# EasyEDA schematic SCH_Task7.3D PCB Design_2022-05-29.json
TITLE: Task 7.3D Canvas; REV: 1.0; Date: 2022-05-29; Sheet: 1/1; Drawn By: djsmit@deakin.edu.au; Company: Your Company
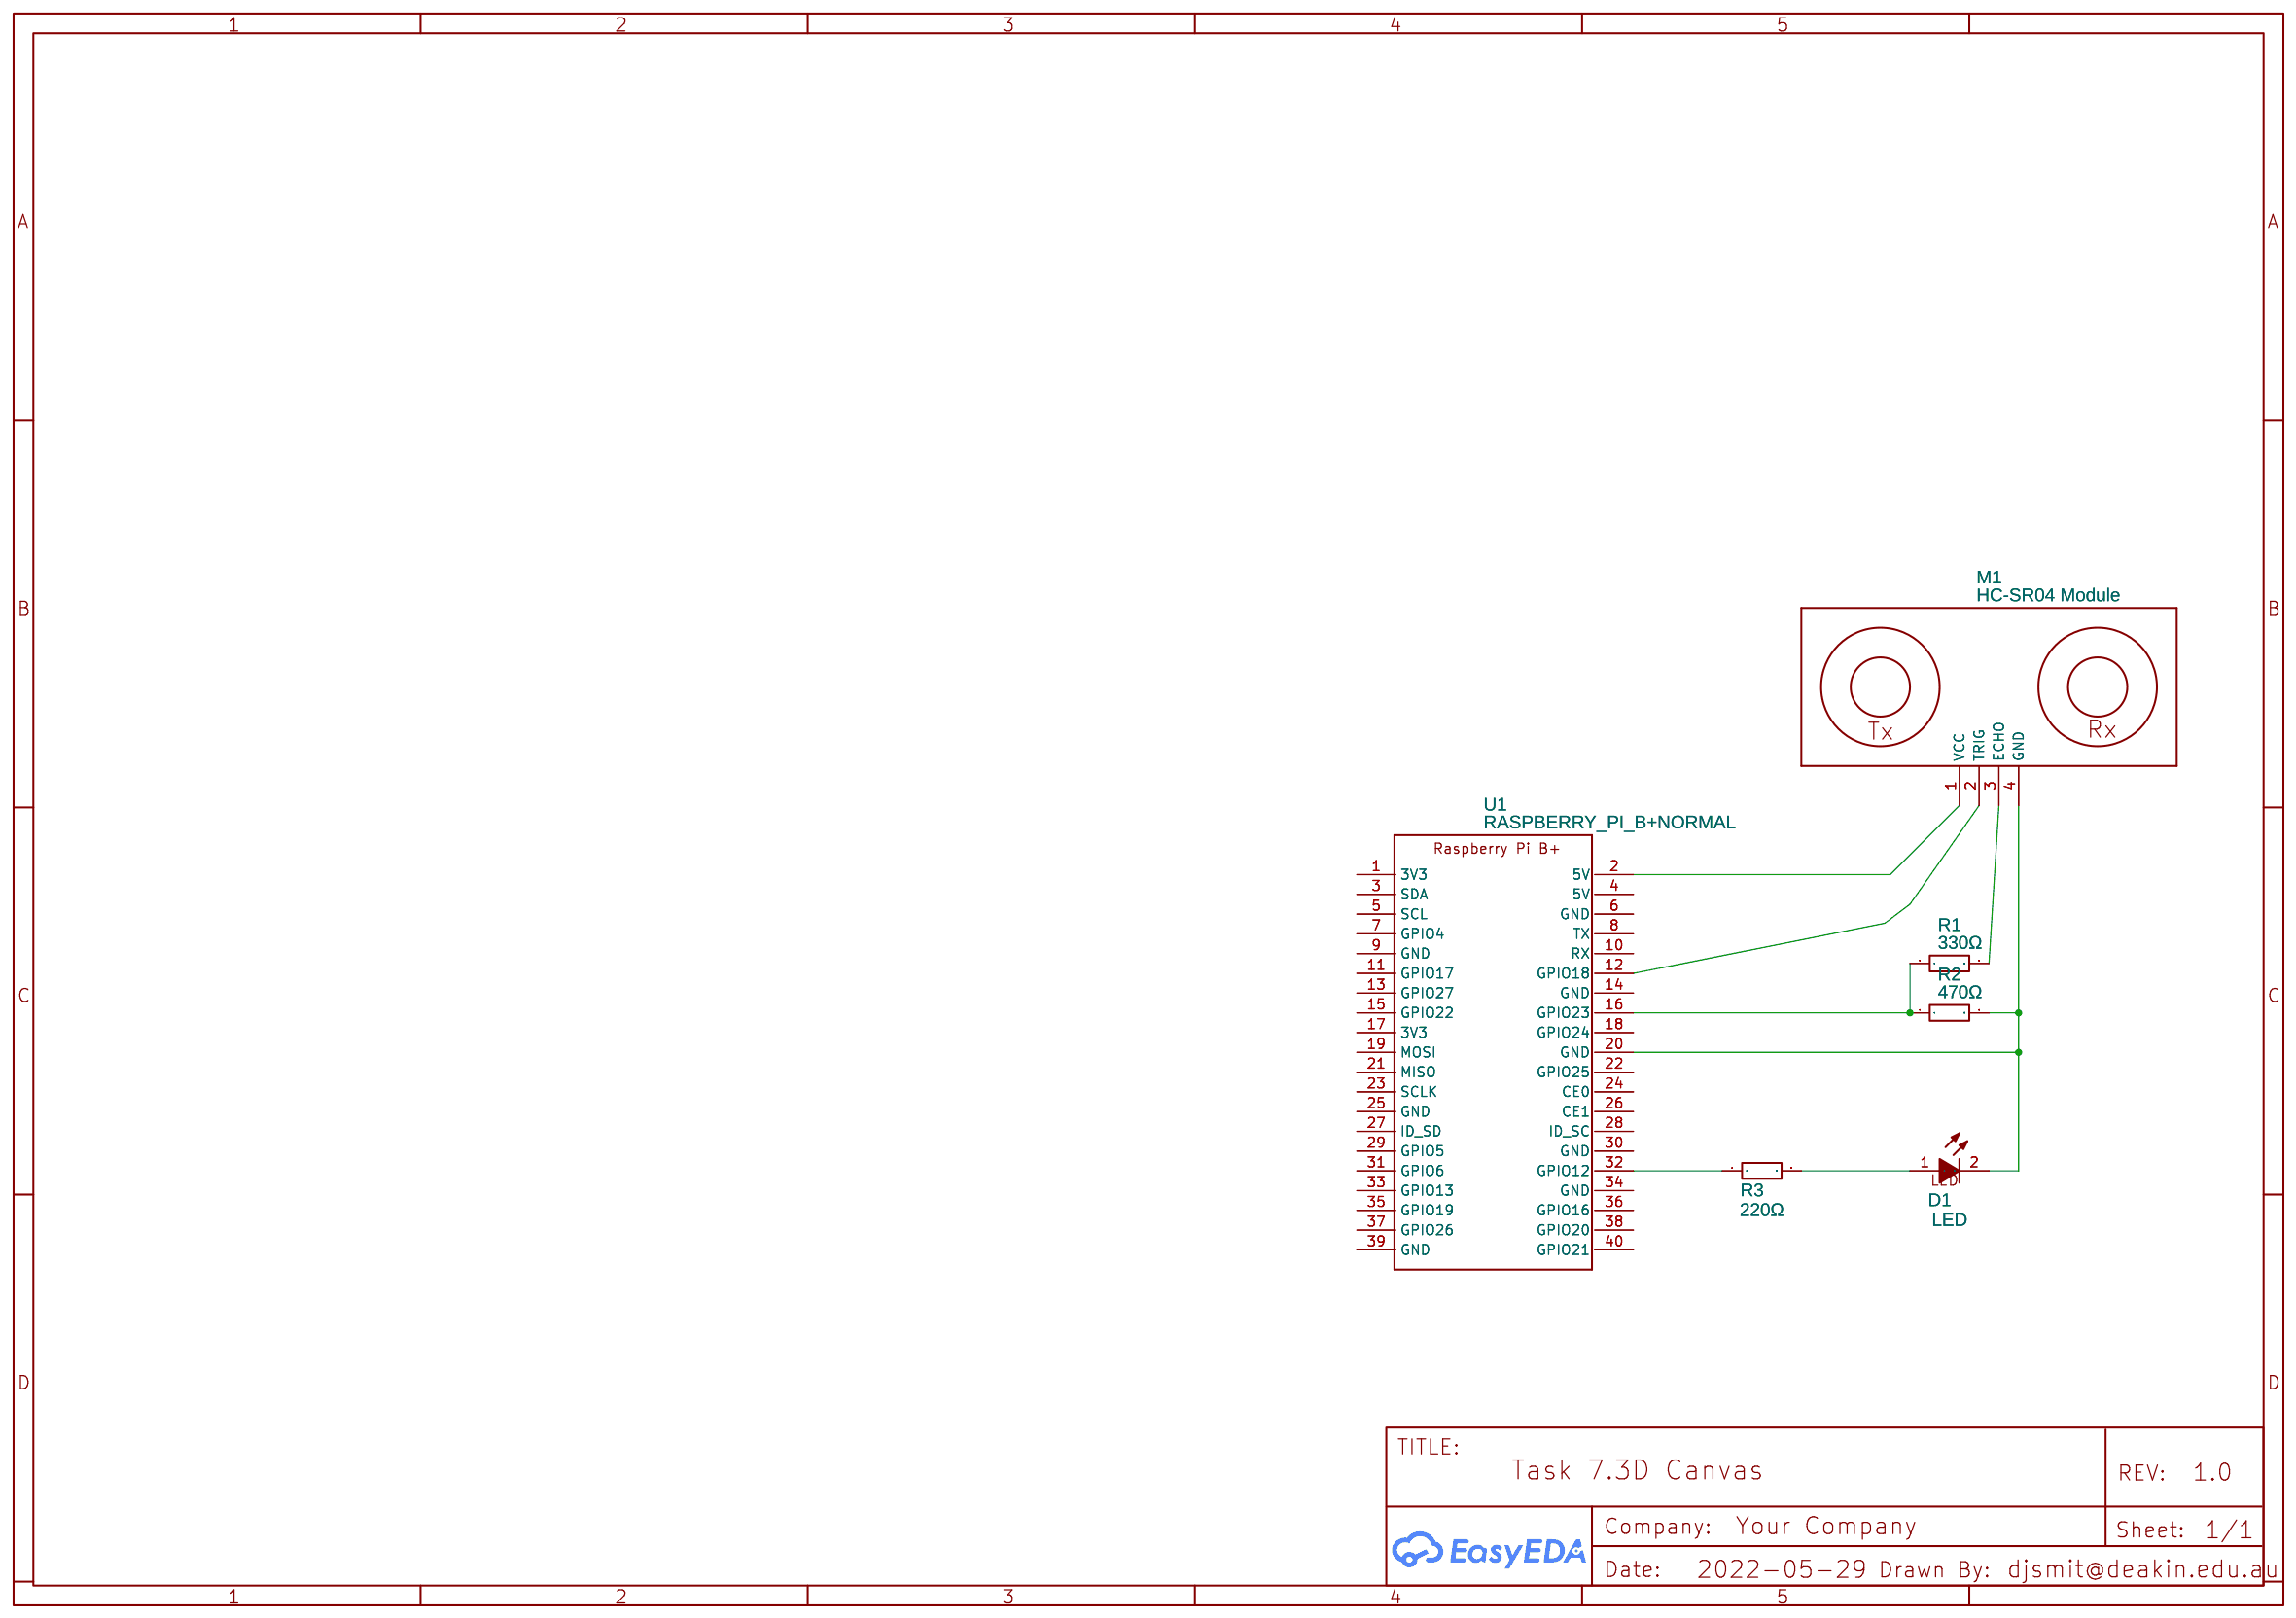
[diagram p0: schematic sheet]

## Parts
D1  LED  [LED-TH_LED-DP2-2LED-AMCC]
M1  HC-SR04 Module  [HC-SR04]
R1  330Ω  [AXIAL-0.4]
R2  470Ω  [AXIAL-0.4]
R3  220Ω  [AXIAL-0.4]
U1  RASPBERRY_PI_B+NORMAL  [RASPBERRY_PI_B+]

## Library data of the parts
D1 = LED: Supplier: Digi-Key; Manufacturer: VccLite; Manufacturer Part: 5600; Supplier Part: L20325-ND; link: https://vcclite.com/product/5602f5-5v/; Contributor: robosnake26
M1 = HC-SR04 Module: Ultrasonic Ranging Module HC-SR04; Contributor: Rayvenhaus; Supplier: Add New Supplier
R1-R3 = 330 OHM Resistor THT (c58608): Supplier: LCSC; Manufacturer: UniOhm; Manufacturer Part: MFR0W4F3300A50; Supplier Part: C58608
U1 = RASPBERRY_PI_B+NORMAL: Contributor: kleverfp

## Nets
Net-(D1-1): D1.1(A) R3.2
Net-(D1-2): D1.2(K) M1.4(GND) R2.2 U1.20(GND)
Net-(M1-1): M1.1(VCC) U1.2(5V)
Net-(M1-2): M1.2(TRIG) U1.12(GPIO18)
Net-(M1-3): M1.3(ECHO) R1.2
Net-(R1-1): R1.1 R2.1 U1.16(GPIO23)
Net-(R3-1): R3.1 U1.32(GPIO12)

Not connected (* = marked no-connect by the designer): U1 1(3V3) 3(SDA) 4(5V) 5(SCL) 6(GND) 7(GPIO4) 8(TX) 9(GND) 10(RX) 11(GPIO17) 13(GPIO27) 14(GND) 15(GPIO22) 17(3V3) 18(GPIO24) 19(MOSI) 21(MISO) 22(GPIO25) 23(SCLK) 24(CE0) 25(GND) 26(CE1) 27(ID_SD) 28(ID_SC) 29(GPIO5) 30(GND) 31(GPIO6) 33(GPIO13) 34(GND) 35(GPIO19) 36(GPIO16) 37(GPIO26) 38(GPIO20) 39(GND) 40(GPIO21)
